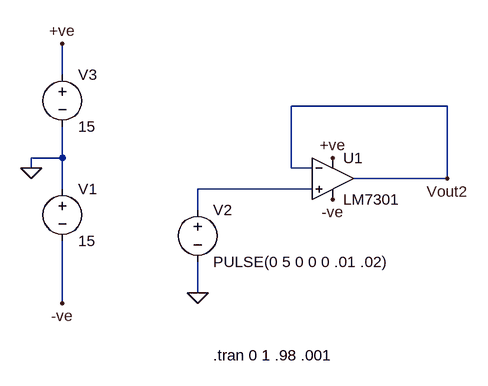
[diagram p0: schematic slewRate.asc]
slewRate.asc, the LTspice schematic file:
Version 4
SHEET 1 972 680
WIRE 192 0 192 -48
WIRE 784 48 544 48
WIRE 192 128 192 80
WIRE 192 128 144 128
WIRE 144 144 144 128
WIRE 544 144 544 48
WIRE 576 144 544 144
WIRE 784 160 784 48
WIRE 784 160 640 160
WIRE 192 176 192 128
WIRE 576 176 400 176
WIRE 400 208 400 176
WIRE 400 336 400 288
WIRE 192 352 192 256
FLAG 144 144 0
FLAG 192 -48 +ve
FLAG 192 352 -ve
FLAG 400 336 0
FLAG 784 160 Vout2
FLAG 608 128 +ve
FLAG 608 192 -ve
SYMBOL voltage 192 160 R0
WINDOW 123 0 0 Left 0
WINDOW 39 0 0 Left 0
SYMATTR InstName V1
SYMATTR Value 15
SYMBOL voltage 400 192 R0
WINDOW 123 0 0 Left 0
WINDOW 39 0 0 Left 0
SYMATTR InstName V2
SYMATTR Value PULSE(0 5 0 0 0 .01 .02)
SYMBOL voltage 192 -16 R0
WINDOW 123 0 0 Left 0
WINDOW 39 0 0 Left 0
SYMATTR InstName V3
SYMATTR Value 15
SYMBOL ValVol\\TI\\LM7301 608 96 R0
SYMATTR InstName U1
TEXT 424 432 Left 2 !.tran 0 1 .98 .001

The netlist it stands for:
* slewRate.asc
V1 0 -ve 15
V2 N001 0 PULSE(0 5 0 0 0 .01 .02)
V3 +ve 0 15
* U1: LM7301 (symbol ValVol\TI\LM7301 not available, pins judged from their places): In+=N001 In-=Vout2 V+=+ve V-=-ve OUT=Vout2
.tran 0 1 .98 .001
.backanno
.end